# Altium project XEM7310_Berakout.PrjPcb
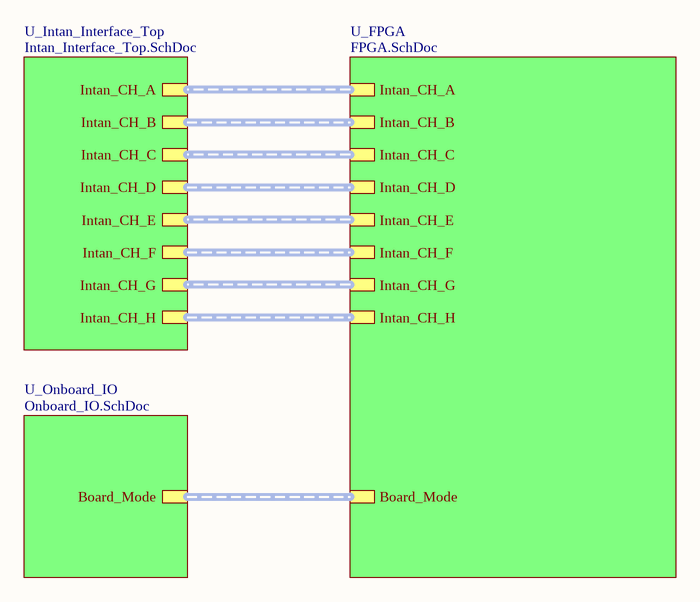
[diagram p0: Title_Page.SchDoc]
Project_Date: 2026-04-02; Project_DateCode: DCXXXX; Project_Designer1: Olivier Bergeron; Project_Global: UHD-EMG; Project_Group: SBioML; Project_Name: XEM7310 Breakout Board; Project_Revision: 1.000; Project_Stencil_Bot_Thickness: 0.1 MM; Project_Stencil_Top_Thickness: 0.1 MM
2 sheets, 6 parts. Net scope: hierarchical (ports join the sheet entries above them; power ports are global).
Board file: XEM7310_Breakout.PcbDoc
Sheets:
  Title_Page.SchDoc
  Intan_Interface.SchDoc

## Sheet Title_Page.SchDoc
size Tabloid; SheetNumber: 1; SheetTotal: 5; Sheet_Name: Title Page; Size: 11x17

### Sub-sheets
U_FPGA = FPGA.SchDoc (file not in this document): Board_Mode (harness Board_Mode), Intan_CH_A (harness Intan_CH), Intan_CH_B (harness Intan_CH), Intan_CH_C (harness Intan_CH), Intan_CH_D (harness Intan_CH), Intan_CH_E (harness Intan_CH), Intan_CH_F (harness Intan_CH), Intan_CH_G (harness Intan_CH), Intan_CH_H (harness Intan_CH)
U_Intan_Interface_Top = Intan_Interface_Top.SchDoc (file not in this document): Intan_CH_A (harness Intan_CH), Intan_CH_B (harness Intan_CH), Intan_CH_C (harness Intan_CH), Intan_CH_D (harness Intan_CH), Intan_CH_E (harness Intan_CH), Intan_CH_F (harness Intan_CH), Intan_CH_G (harness Intan_CH), Intan_CH_H (harness Intan_CH)
U_Onboard_IO = Onboard_IO.SchDoc (file not in this document): Board_Mode (harness Board_Mode)

### Buses and harness runs
harness sheet U_FPGA/Board_Mode = sheet U_Onboard_IO/Board_Mode
harness sheet U_FPGA/Intan_CH_A = sheet U_Intan_Interface_Top/Intan_CH_A
harness sheet U_FPGA/Intan_CH_B = sheet U_Intan_Interface_Top/Intan_CH_B
harness sheet U_FPGA/Intan_CH_C = sheet U_Intan_Interface_Top/Intan_CH_C
harness sheet U_FPGA/Intan_CH_D = sheet U_Intan_Interface_Top/Intan_CH_D
harness sheet U_FPGA/Intan_CH_E = sheet U_Intan_Interface_Top/Intan_CH_E
harness sheet U_FPGA/Intan_CH_F = sheet U_Intan_Interface_Top/Intan_CH_F
harness sheet U_FPGA/Intan_CH_G = sheet U_Intan_Interface_Top/Intan_CH_G
harness sheet U_FPGA/Intan_CH_H = sheet U_Intan_Interface_Top/Intan_CH_H

### Notes on the sheet
- Sheet Name
- Project Title
- Global Project
- Size
- Group
- Revision
- Date
- Sheet
- of
- Filename
- Designers

## Sheet Intan_Interface.SchDoc
size Tabloid; SheetNumber: 5; SheetTotal: 5; Sheet_Name: Intan Interface; Size: 11x17
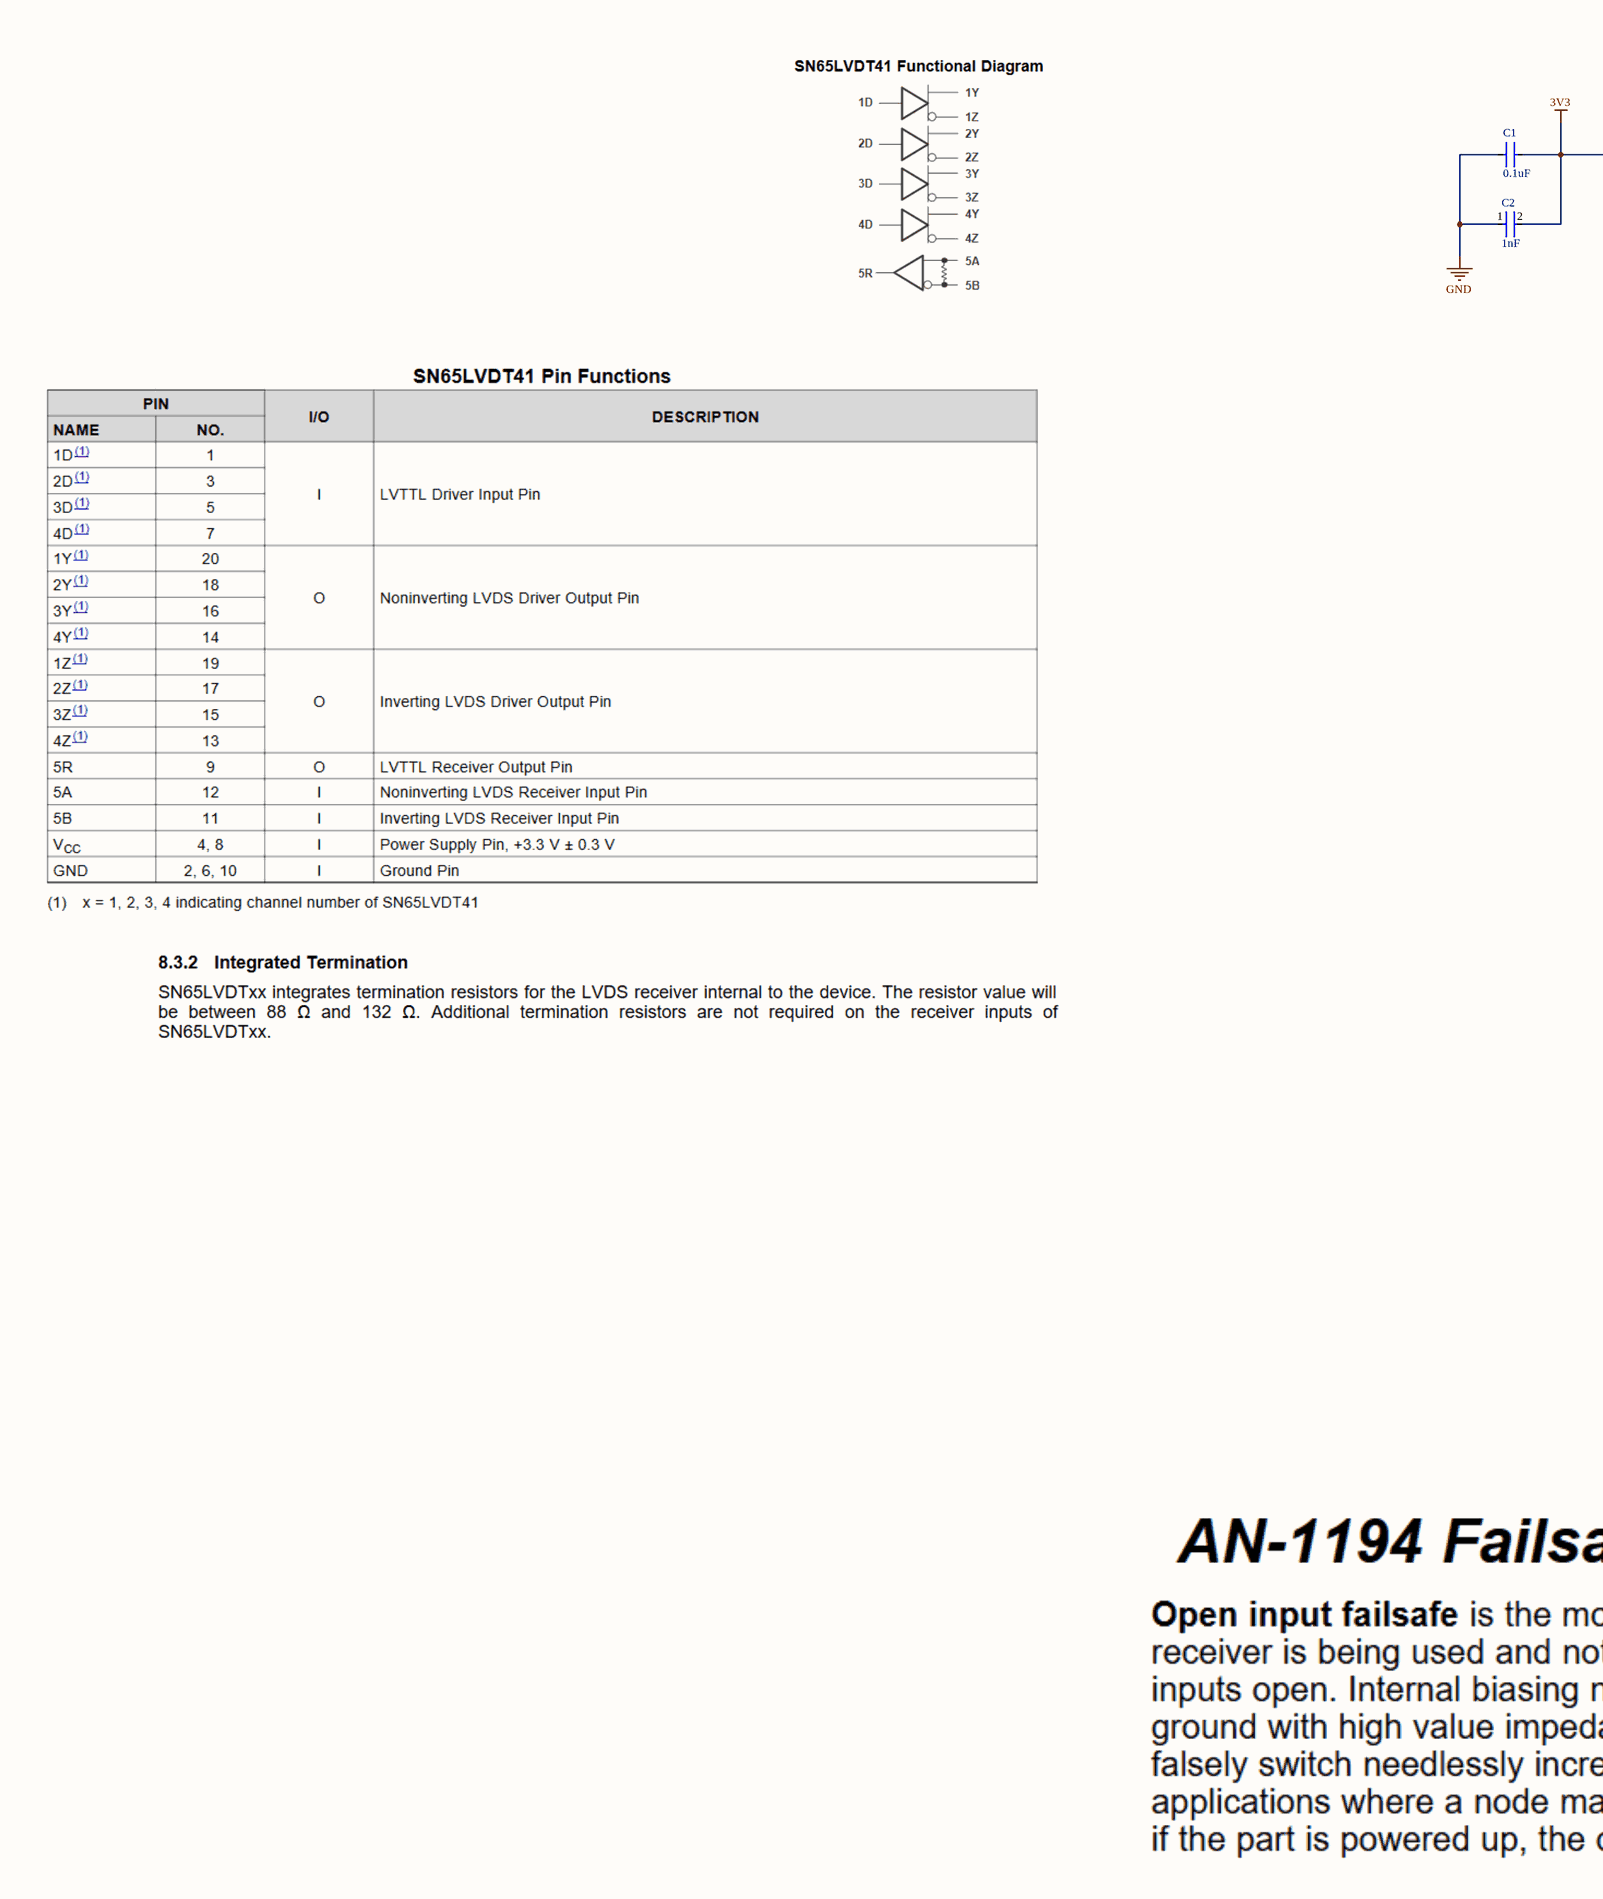
[diagram p1: Intan_Interface.SchDoc, left]
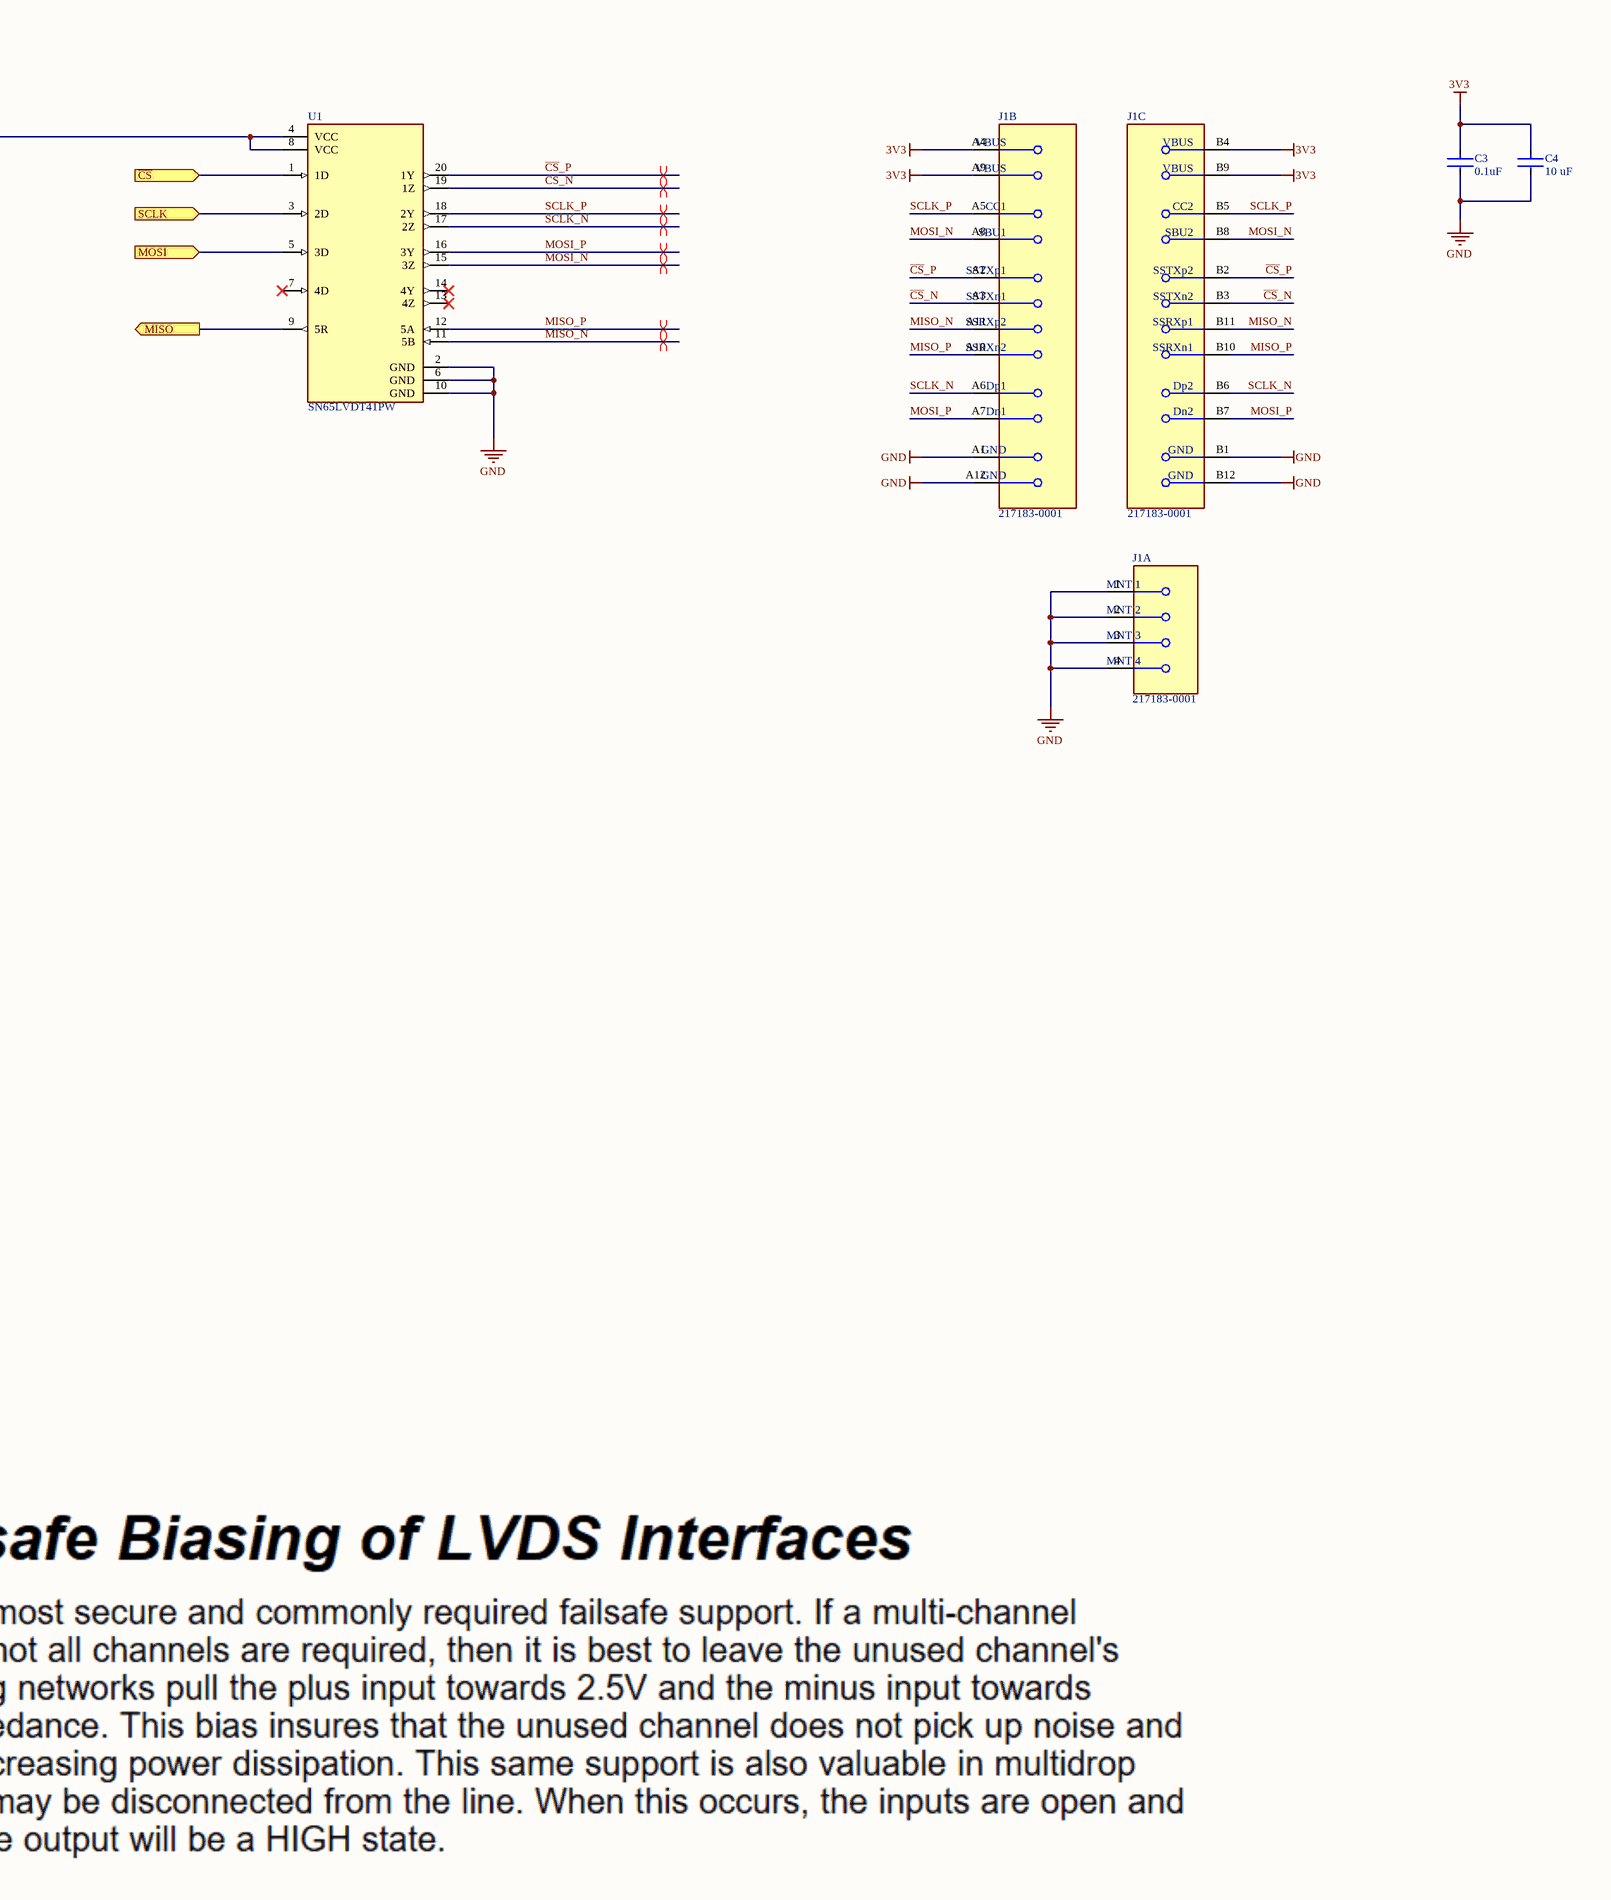
[diagram p2: Intan_Interface.SchDoc, right]

### Parts
C1  0.1uF  [FP-CC0603-DA-IPC_B]
C2  1nF  [FP-CL10-IPC_A]
C3  0.1uF  [FP-CC0603-DA-IPC_B]
C4  10 uF  [FP-GRM188-0_2-IPC_C]
J1  217183-0001  [FP-217183-0001-MFG]  (parts A,B,C of 3)
U1  SN65LVDT41PW  [FP-PW0020A-IPC_C]

### Ports
MISO (out), MOSI (in), SCLK (in), ~{CS} (in)

### Nets
3V3: C1.1 C2.2 C3.1 C4.1 J1.A4(VBUS) J1.A9(VBUS) J1.B4(VBUS) J1.B9(VBUS) U1.4(VCC) U1.8(VCC)
GND: C1.2 C2.1 C3.2 C4.2 J1.1(MNT_1) J1.2(MNT_2) J1.3(MNT_3) J1.4(MNT_4) J1.A1(GND) J1.A12(GND) J1.B1(GND) J1.B12(GND) U1.2(GND) U1.6(GND) U1.10(GND)
~{CS}: U1.1(1D) ; port ~{CS}
~{CS}_N: J1.A3(SSTXn1) J1.B3(SSTXn2) U1.19(1Z)
~{CS}_P: J1.A2(SSTXp1) J1.B2(SSTXp2) U1.20(1Y)
MISO: U1.9(5R) ; port MISO
MISO_N: J1.A11(SSRXp2) J1.B11(SSRXp1) U1.11(5B)
MISO_P: J1.A10(SSRXn2) J1.B10(SSRXn1) U1.12(5A)
MOSI: U1.5(3D) ; port MOSI
MOSI_N: J1.A8(SBU1) J1.B8(SBU2) U1.15(3Z)
MOSI_P: J1.A7(Dn1) J1.B7(Dn2) U1.16(3Y)
SCLK: U1.3(2D) ; port SCLK
SCLK_N: J1.A6(Dp1) J1.B6(Dp2) U1.17(2Z)
SCLK_P: J1.A5(CC1) J1.B5(CC2) U1.18(2Y)

Not connected (* = marked no-connect by the designer): U1 7(4D)* 13(4Z)* 14(4Y)*

### Layout directives
differential pair: MISO_N, MISO_P, MOSI_N, MOSI_P, SCLK_N, SCLK_P, ~{CS}_N, ~{CS}_P

### Notes on the sheet
- Sheet Name
- Project Title
- Global Project
- Size
- Group
- Revision
- Date
- Sheet
- of
- Filename
- Designers

### Library data of the parts
C1 C3 = CAP_0U10_0603: CAP CER 0.1UF 50V X7R 0603; Manufacturer: YAGEO; Manufacturer Part Number: CC0603KRX7R9BB104; Material: Ceramic; Capacitance: 100 nF; Temperature Coefficient: 15%; Tolerance: 0.1; Value: 100 nF; Height: 0.9mm; Voltage: 50 V; ComponentLink2Description: Datasheet; Device Class L2: Capacitors; Temperature Range High: +125°C; Category: Cap; Footprint Url: http://www.yageo.com/exep/pages/download/literatures/UPY-C_GEN_24.pdf; ComponentLink2URL: http://www.yageo.com/documents/recent/UPY-GPHC_X7R_6.3V-to-50V_18.pdf; Package: CC0603-DA; Temperature: -55°C to +125°C; Voltage Rating: 50 V; Temperature Characteristic: X7R; Device Class L1: Passive Components; Temperature Range Low: -55°C; RoHS: TRUE; Automotive: No; Device Class L3: Ceramic Capacitors; Octopart: https://octopart.com/cc0603krx7r9bb104-yageo-42244635; Mouser Description: Multilayer Ceramic Capacitor, CC Series, 0.1 - F, - 10%, X7R, 50 V, 0603 [1608 Metric]; Lead Free: Yes; Digikey Description: CAP CER 0.1UF 50V X7R 0603
C2 = CAP_1N00_0603: Cap Ceramic 1nF 50V X7R ±10% Pad SMD 0603 +125°C T/R; Radiation Hardening: No; Length: 1.6mm; Capacitance: 1nF; Voltage Rating: 50V; Case Code (Imperial): 0603; Case Code (Metric): 1608; Max Operating Temperature: 125°C; Thickness: 0.035inch; Voltage Rating (DC): 50V; Contact Plating: Tin; Width: 0.031inch; Mount: Surface Mount; Lead Free: Lead Free; Voltage: 50V; Material: Ceramic; Package Quantity: 1; Dielectric: X7R; Case/Package: 0603; Height: 0.8mm; Min Operating Temperature: -55°C; Tolerance: 10%; Depth: 0.8mm; Packaging: Tape and Reel
C4 = CAP_10U0_0603: Chip Multilayer Ceramic Capacitors for General Purpose, 0603, 10uF, X7R, 15%, 10%, 10V
J1 = CON_USBC_TH_SMT: USB-C (USB TYPE-C) USB 3.2 Gen 1 (USB 3.1 Gen 1, Superspeed (USB 3.0)) Receptacle Connector 24 Position Through Hole, Right Angle
U1 = CMP-04872-000210-1: IC TRANSCEIVER HALF 4/1 20TSSOP; Number of Transmitters: 4; Turn-On Delay Time: 3.8ns; Number of Transceivers: 1; Max Supply Current: 35mA; Max Supply Voltage: 3.6V; Data Rate: 125Mbps; Min Supply Voltage: 3V; Logic Function: Buffer; Power Dissipation: 774mW; Operating Supply Voltage: 3.3V; Output Voltage: 2.4V; Max Operating Temperature: 85°C; Package Quantity: 70; Packaging: Rail/Tube; Propagation Delay: 3.8ns; Min Operating Temperature: -40°C; Number of Receivers: 4; REACH SVHC: No SVHC; Weight: 0.002716oz; Height: 1.15mm; RoHS Compliant: Yes; Case/Package: TSSOP; Nominal Supply Current: 35mA; Number of Drivers: 1; Width: 4.4mm; Length: 6.5mm; Series: 65LVDT; Radiation Hardening: No; Supply Current: 35mA; Mount: Surface Mount; Lead Free: Lead Free; Number of Pins: 20; Operating Supply Current: 35mA; Number of Elements: 1